# EAGLE design remote (EAGLE 6.6.0)
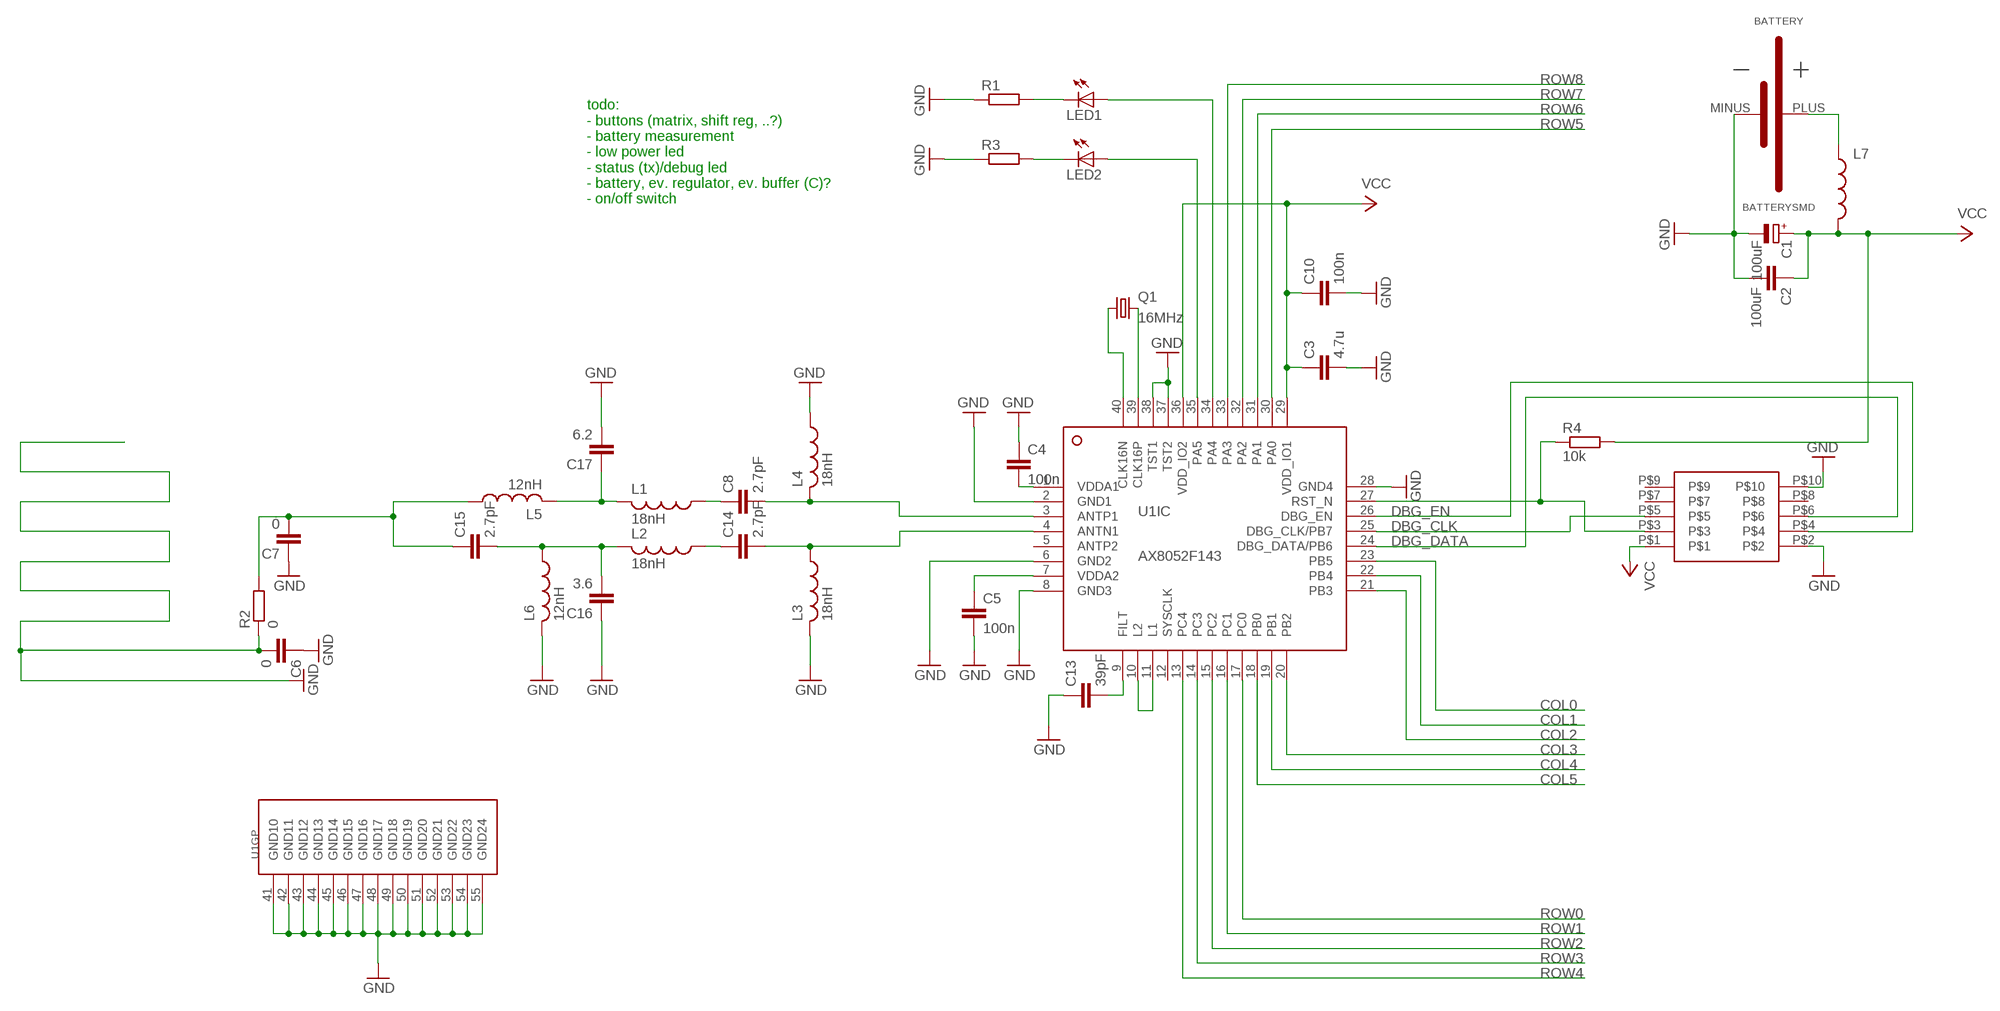
[diagram p0: schematic, sheet 1, part 1 of 2]
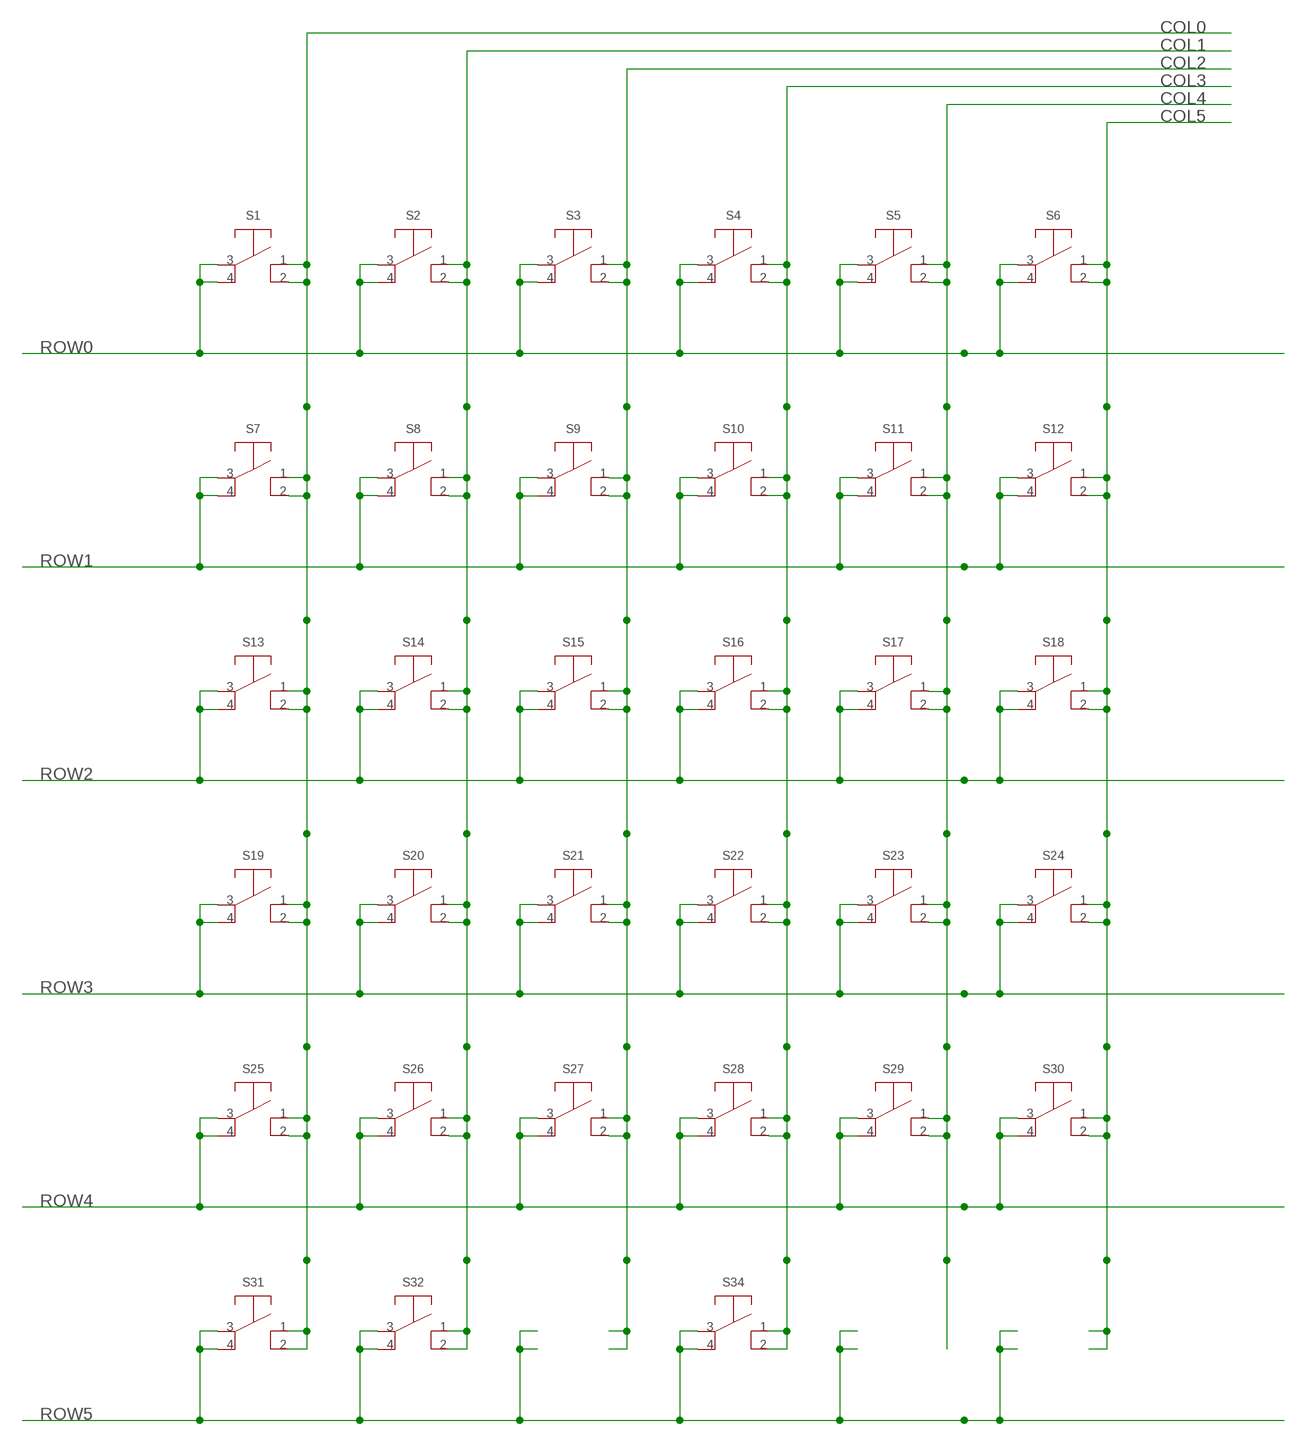
[diagram p1: schematic, sheet 1, part 2 of 2]

## Parts
BATTERY  BATTERYSMD  [CR2032-SMD]
C1  100uF  CPOL-EUE  [PANASONIC_E]
C2  100uF  C-EUC1206K  [C1206K]
C3  4.7u  C-EUC0805  [C0805]
C4  100n  C-EUC0603  [C0603]
C5  100n  C-EUC0603  [C0603]
C6  0  C-EUC0805  [C0805]
C7  0  C-EUC0805  [C0805]
C8  2.7pF  C-EUC0805  [C0805]
C10  100n  C-EUC0603  [C0603]
C13  39pF  C-EUC0805  [C0805]
C14  2.7pF  C-EUC0805  [C0805]
C15  2.7pF  C-EUC0805  [C0805]
C16  3.6  C-EUC0805  [C0805]
C17  6.2  C-EUC0805  [C0805]
L1  18nH  L-US0603  [C0603]
L2  18nH  L-US0603  [C0603]
L3  18nH  L-US0603  [C0603]
L4  18nH  L-US0603  [C0603]
L5  12nH  L-US0603  [C0603]
L6  12nH  L-US0603  [C0603]
L7  INDUCTORNPI75  [NPI75C]
LED1  LEDCHIPLED_1206  [CHIPLED_1206]
LED2  LEDCHIPLED_1206  [CHIPLED_1206]
Q1  16MHz  CRYSTALSM49  [SM49]
R1  R-EU_R0603  [R0603]
R2  0  R-EU_R0603  [R0603]
R3  R-EU_R0603  [R0603]
R4  10k  R-EU_R0603  [R0603]
S1  SWITCHSMD  [TACTILE_SWITCH_FSM2JSMA]
S2  SWITCHSMD  [TACTILE_SWITCH_FSM2JSMA]
S3  SWITCHSMD  [TACTILE_SWITCH_FSM2JSMA]
S4  SWITCHSMD  [TACTILE_SWITCH_FSM2JSMA]
S5  SWITCHSMD  [TACTILE_SWITCH_FSM2JSMA]
S6  SWITCHSMD  [TACTILE_SWITCH_FSM2JSMA]
S7  SWITCHSMD  [TACTILE_SWITCH_FSM2JSMA]
S8  SWITCHSMD  [TACTILE_SWITCH_FSM2JSMA]
S9  SWITCHSMD  [TACTILE_SWITCH_FSM2JSMA]
S10  SWITCHSMD  [TACTILE_SWITCH_FSM2JSMA]
S11  SWITCHSMD  [TACTILE_SWITCH_FSM2JSMA]
S12  SWITCHSMD  [TACTILE_SWITCH_FSM2JSMA]
S13  SWITCHSMD  [TACTILE_SWITCH_FSM2JSMA]
S14  SWITCHSMD  [TACTILE_SWITCH_FSM2JSMA]
S15  SWITCHSMD  [TACTILE_SWITCH_FSM2JSMA]
S16  SWITCHSMD  [TACTILE_SWITCH_FSM2JSMA]
S17  SWITCHSMD  [TACTILE_SWITCH_FSM2JSMA]
S18  SWITCHSMD  [TACTILE_SWITCH_FSM2JSMA]
S19  SWITCHSMD  [TACTILE_SWITCH_FSM2JSMA]
S20  SWITCHSMD  [TACTILE_SWITCH_FSM2JSMA]
S21  SWITCHSMD  [TACTILE_SWITCH_FSM2JSMA]
S22  SWITCHSMD  [TACTILE_SWITCH_FSM2JSMA]
S23  SWITCHSMD  [TACTILE_SWITCH_FSM2JSMA]
S24  SWITCHSMD  [TACTILE_SWITCH_FSM2JSMA]
S25  SWITCHSMD  [TACTILE_SWITCH_FSM2JSMA]
S26  SWITCHSMD  [TACTILE_SWITCH_FSM2JSMA]
S27  SWITCHSMD  [TACTILE_SWITCH_FSM2JSMA]
S28  SWITCHSMD  [TACTILE_SWITCH_FSM2JSMA]
S29  SWITCHSMD  [TACTILE_SWITCH_FSM2JSMA]
S30  SWITCHSMD  [TACTILE_SWITCH_FSM2JSMA]
S31  SWITCHSMD  [TACTILE_SWITCH_FSM2JSMA]
S32  SWITCHSMD  [TACTILE_SWITCH_FSM2JSMA]
S34  SWITCHSMD  [TACTILE_SWITCH_FSM2JSMA]
U1  AX8052F143HS  [QFN40-H]
U$2  2X5PIN-CONNECTOR  [2X5PIN-CONNECTOR-SMD]

## Nets
COL0: S1.P1 S1.P2 S7.P1 S7.P2 S13.P1 S13.P2 S19.P1 S19.P2 S25.P1 S25.P2 S31.P1 S31.P2 U1.23(IC:PB5)
COL1: S2.P1 S2.P2 S8.P1 S8.P2 S14.P1 S14.P2 S20.P1 S20.P2 S26.P1 S26.P2 S32.P1 S32.P2 U1.22(IC:PB4)
COL2: S3.P1 S3.P2 S9.P1 S9.P2 S15.P1 S15.P2 S21.P1 S21.P2 S27.P1 S27.P2 U1.21(IC:PB3)
COL3: S4.P1 S4.P2 S10.P1 S10.P2 S16.P1 S16.P2 S22.P1 S22.P2 S28.P1 S28.P2 S34.P1 S34.P2 U1.20(IC:PB2)
COL4: S5.P1 S5.P2 S11.P1 S11.P2 S17.P1 S17.P2 S23.P1 S23.P2 S29.P1 S29.P2 U1.19(IC:PB1)
COL5: S6.P1 S6.P2 S12.P1 S12.P2 S18.P1 S18.P2 S24.P1 S24.P2 S30.P1 S30.P2 U1.18(IC:PB0)
DBG_CLK: U1.25(IC:DBG_CLK/PB7) U$2.P$5
DBG_DATA: U1.24(IC:DBG_DATA/PB6) U$2.P$6
DBG_EN: U1.26(IC:DBG_EN) U$2.P$4
GND: BATTERY.MINUS C1.- C2.2 C3.2 C4.1 C5.2 C6.1 C6.2 C7.1 C10.2 C13.1 C16.1 C17.2 L3.2 L4.1 L6.2 R1.1 R2.1 R3.1 U1.2(IC:GND1) U1.6(IC:GND2) U1.8(IC:GND3) U1.28(IC:GND4) U1.37(IC:TST2) U1.38(IC:TST1) U1.41(GP:GND10) U1.42(GP:GND11) U1.43(GP:GND12) U1.44(GP:GND13) U1.45(GP:GND14) U1.46(GP:GND15) U1.47(GP:GND16) U1.48(GP:GND17) U1.49(GP:GND18) U1.50(GP:GND19) U1.51(GP:GND20) U1.52(GP:GND21) U1.53(GP:GND22) U1.54(GP:GND23) U1.55(GP:GND24) U$2.P$2 U$2.P$10
N$1: U1.10(IC:L2) U1.11(IC:L1)
N$2: C13.2 U1.9(IC:FILT)
N$3: C4.2 U1.1(IC:VDDA1)
N$4: LED1.A U1.34(IC:PA4)
N$5: R4.1 U1.27(IC:RST_N) U$2.P$3
N$6: C5.1 U1.7(IC:VDDA2)
N$7: C8.2 L4.2 U1.3(IC:ANTP1)
N$8: C14.2 L3.1 U1.4(IC:ANTN1)
N$9: C8.1 L1.1
N$10: C14.1 L2.1
N$11: LED2.A U1.35(IC:PA5)
N$12: C17.1 L1.2 L5.2
N$13: C15.2 C16.2 L2.2 L6.1
N$14: Q1.2 U1.39(IC:CLK16P)
N$15: Q1.1 U1.40(IC:CLK16N)
N$16: LED2.C R3.2
N$17: LED1.C R1.2
N$18: BATTERY.PLUS L7.1
N$20: C7.2 C15.1 L5.1 R2.2
ROW0: S1.P3 S1.P4 S2.P3 S2.P4 S3.P3 S3.P4 S4.P3 S4.P4 S5.P3 S5.P4 S6.P3 S6.P4 U1.17(IC:PC0)
ROW1: S7.P3 S7.P4 S8.P3 S8.P4 S9.P3 S9.P4 S10.P3 S10.P4 S11.P3 S11.P4 S12.P3 S12.P4 U1.16(IC:PC1)
ROW2: S13.P3 S13.P4 S14.P3 S14.P4 S15.P3 S15.P4 S16.P3 S16.P4 S17.P3 S17.P4 S18.P3 S18.P4 U1.15(IC:PC2)
ROW3: S19.P3 S19.P4 S20.P3 S20.P4 S21.P3 S21.P4 S22.P3 S22.P4 S23.P3 S23.P4 S24.P3 S24.P4 U1.14(IC:PC3)
ROW4: S25.P3 S25.P4 S26.P3 S26.P4 S27.P3 S27.P4 S28.P3 S28.P4 S29.P3 S29.P4 S30.P3 S30.P4 U1.13(IC:PC4)
ROW5: S31.P3 S31.P4 S32.P3 S32.P4 S34.P3 S34.P4 U1.30(IC:PA0)
ROW6: U1.31(IC:PA1)
ROW7: U1.32(IC:PA2)
ROW8: U1.33(IC:PA3)
VCC: C1.+ C2.1 C3.1 C10.1 L7.2 R4.2 U1.29(IC:VDD_IO1) U1.36(IC:VDD_IO2) U$2.P$1
Unconnected: U1.5(IC:ANTP2) U1.12(IC:SYSCLK) U$2.P$7 U$2.P$8 U$2.P$9

## Notes on the sheet
- todo:
  - buttons (matrix, shift reg, ..?)
  - battery measurement
  - low power led
  - status (tx)/debug led
  - battery, ev. regulator, ev. buffer (C)?
  - on/off switch

## Library data of the parts
BATTERY = sam:BATTERY
C1 = resistor:CPOL-EU: POLARIZED CAPACITOR, European symbol
C2-C8 C10 C13-C17 = resistor:C-EU: CAPACITOR, European symbol
L1-L6 = resistor:L-US: INDUCTOR, American symbol
L7 = SparkFun-Passives:INDUCTOR: Inductors Basic Inductor/Choke - 0603 and 1206. Footprints are not proven and vary greatly between part numbers. SRN6045- 33uH, 20% 1.4A SDR0403-560KL - 56uH, 10%, 500mA RMS/740mA peak
LED1 LED2 = led:LED: LED OSRAM: - CHIPLED LG R971, LG N971, LY N971, LG Q971, LY Q971, LO R971, LY R971 LH N974, LH R974 LS Q976, LO Q976, LY Q976 LO Q996 - Hyper CHIPLED LW Q18S LB Q993, LB Q99A, LB R99A - SideLED LS A670, LO A670, LY A670, LG A670, LP A670 LB A673, LV A673, LT A673, LW A673 LH A674 LY A675 LS A676, LA A676, LO A676, LY A676, LW A676 LS A679, LY A679, LG A679 - Hyper Micro SIDELED® LS Y876, LA Y876, LO Y876, LY Y876 LT Y87S - SmartLED LW L88C, LW L88S LB L89C, LB L89S, LG L890 LS L89K, LO L89K, LY L89K LS L896, LA L896, LO L896, LY L896 - TOPLED LS T670, LO T670, LY T670, LG T670, LP T670 LSG T670, LSP T670, LSY T670, LOP T670, LYG T670 LG T671, LOG T671, LSG T671 LB T673, LV T673, LT T673, LW T673 LH T674 LS T676, LA T676, LO T676, LY T676, LB T676, LH T676, LSB T676, LW T676 LB T67C, LV T67C, LT T67C, LS T67K, LO T67K, LY T67K, LW E67C LS E67B, LA E67B, LO E67B, LY E67B, LB E67C, LV E67C, LT E67C LW T67C LS T679, LY T679, LG T679 LS T770, LO T770, LY T770, LG T770, LP T770 LB T773, LV T773, LT T773, LW T773 LH T774 LS E675, LA E675, LY E675, LS T675 LS T776, LA T776, LO T776, LY T776, LB T776 LHGB T686 LT T68C, LB T68C - Hyper Mini TOPLED® LB M676 - Mini TOPLED Santana® LG M470 LS M47K, LO M47K, LY M47K Source: http://www.osram.convergy.de LUXEON: - LUMILED® LXK2-PW12-R00, LXK2-PW12-S00, LXK2-PW14-U00, LXK2-PW14-V00 LXK2-PM12-R00, LXK2-PM12-S00, LXK2-PM14-U00 LXK2-PE12-Q00, LXK2-PE12-R00, LXK2-PE12-S00, LXK2-PE14-T00, LXK2-PE14-U00 LXK2-PB12-K00, LXK2-PB12-L00, LXK2-PB12-M00, LXK2-PB14-N00, LXK2-PB14-P00, LXK2-PB14-Q00 LXK2-PR12-L00, LXK2-PR12-M00, LXK2-PR14-Q00, LXK2-PR14-R00 LXK2-PD12-Q00, LXK2-PD12-R00, LXK2-PD12-S00 LXK2-PH12-R00, LXK2-PH12-S00 LXK2-PL12-P00, LXK2-PL12-Q00, LXK2-PL12-R00 Source: www.luxeon.com KINGBRIGHT: KA-3528ASYC Source: www.kingbright.com
Q1 = crystal:CRYSTAL: CRYSTAL
R1-R4 = resistor:R-EU_: RESISTOR, European symbol
S1-S32 S34 = sam:SWITCH
U1 = axsem_v4-11:AX8052F143: Ultra cool AXSEM low-power narrow-band transceiver with integrated ultra-low-power AX8052 micro-controller
U$2 = sam_eagle_parts:2X5PIN-CONNECTOR

## Net classes
0 default: clearance 0.205 mm

## Board
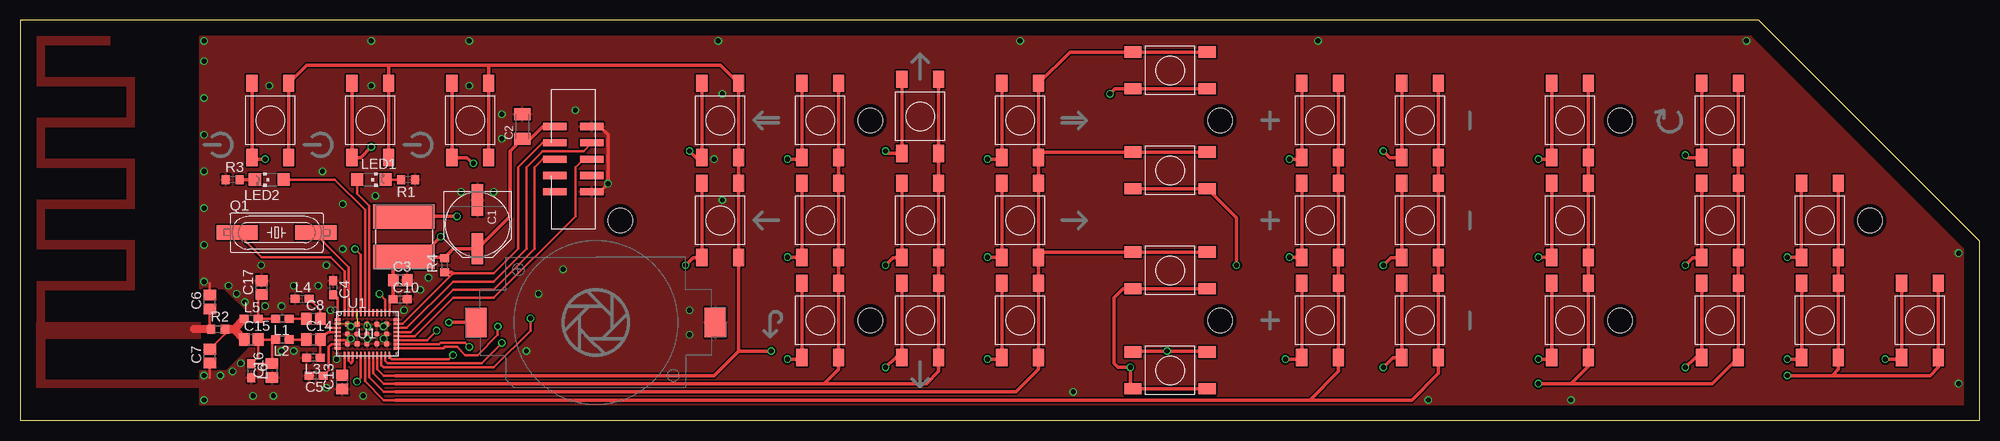
[diagram p2: board, top side]
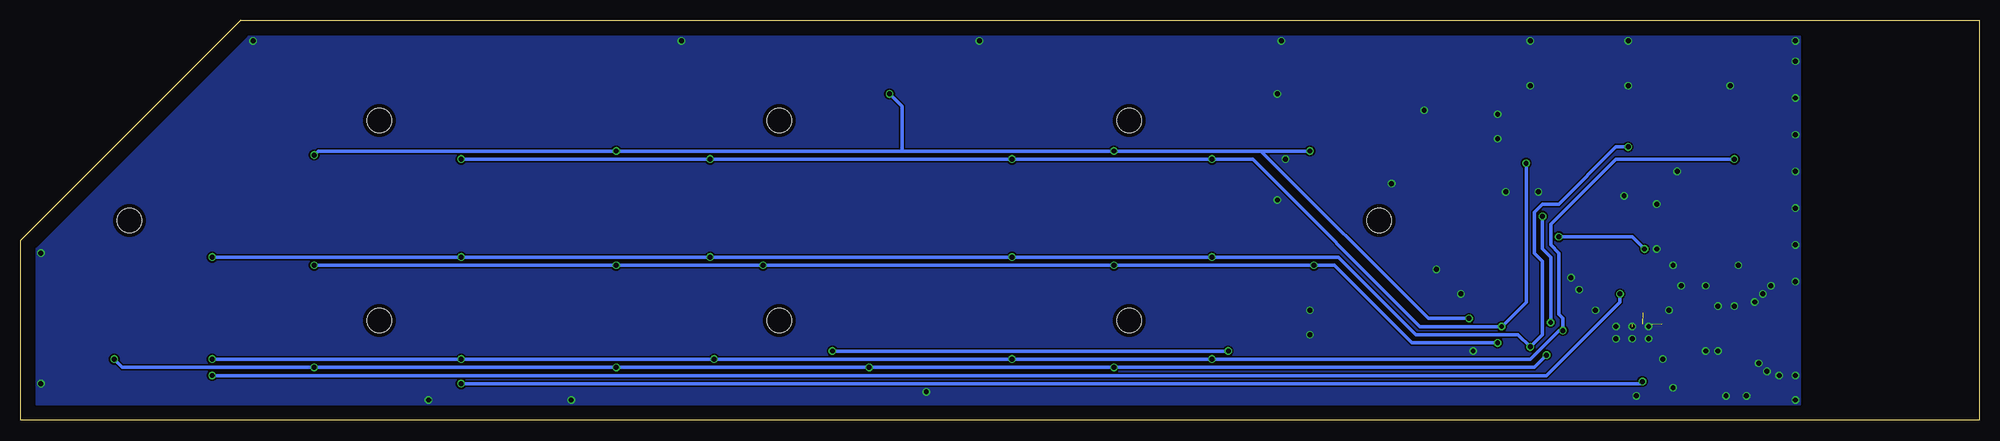
[diagram p3: board, bottom side, seen from below]

Size 240 x 49 mm. Coordinates in mm from the lower left corner, seen from the top.
Outline: 0,0 240,0 240,22 213,49 0,49 0,0
Copper layers (1*16): Top 0.035mm / dielectric 1.5mm / Bottom 0.035mm
Design rules "EagleRules": minimum track width 7mil, minimum drill 12mil, track to track 7mil, track to pad 7mil, pad to pad 7mil, via to via 7mil, smd to smd 0mil, copper to edge 20mil, drill to drill 10mil, minimum pad ring 10mil, minimum via ring 6mil, stop-mask expansion 2mil, vias tented up to drill 25mil, thermal gap 10mil
Holes 3 mm at 73.5,24.5 226.62,24.5 196,12.25 196,36.75 147,36.75 147,12.25 104.12,36.75 104.12,12.25

### Footprints (pad centres in the part's own frame; a part is rotated, then mirrored left to right if it is on the bottom)
CR2032-SMD = smd 2.6 x 3.6: MINUS -14.65,0; PLUS 14.65,0
PANASONIC_E = smd 3.8 x 1.4: + 3,0; - -3,0
C1206K = smd 1.5 x 2: 1 -1.5,0; 2 1.5,0
C0805 = smd 1.3 x 1.5: 1 -0.85,0; 2 0.85,0
C0603 = smd 1.1 x 1: 1 -0.85,0; 2 0.85,0
NPI75C = smd 3 x 7.5: 1 -2.5,0; 2 2.5,0
CHIPLED_1206 = smd 1.5 x 1.5: A 0,-1.75; C 0,1.75
SM49 = smd 5.08 x 1.778: 1 -4.826,0; 2 4.826,0
R0603 = smd 1 x 1.1: 1 -0.85,0; 2 0.85,0
TACTILE_SWITCH_FSM2JSMA = smd 1.4 x 2.1: P1 2.25,4.55; P2 2.25,-4.55; P3 -2.25,4.55; P4 -2.25,-4.55
QFN40-H = smd 0.8 x 0.3: 1 -3.6,1.75; 2 -3.6,1.25; 3 -3.6,0.75; 4 -3.6,0.25; 5 -3.6,-0.25; 6 -3.6,-0.75; 7 -3.6,-1.25; 8 -3.6,-1.75; 21 3.6,-1.75; 22 3.6,-1.25; 23 3.6,-0.75; 24 3.6,-0.25; 25 3.6,0.25; 26 3.6,0.75; 27 3.6,1.25; 28 3.6,1.75 | smd 0.3 x 0.8: 9 -2.75,-2.6; 10 -2.25,-2.6; 11 -1.75,-2.6; 12 -1.25,-2.6; 13 -0.75,-2.6; 14 -0.25,-2.6; 15 0.25,-2.6; 16 0.75,-2.6; 17 1.25,-2.6; 18 1.75,-2.6; 19 2.25,-2.6; 20 2.75,-2.6; 29 2.75,2.6; 30 2.25,2.6; 31 1.75,2.6; 32 1.25,2.6; 33 0.75,2.6; 34 0.25,2.6; 35 -0.25,2.6; 36 -0.75,2.6; 37 -1.25,2.6; 38 -1.75,2.6; 39 -2.25,2.6; 40 -2.75,2.6 | smd 0.65 x 0.65: 41 -2.4,1.2; 42 -2.4,0; 43 -2.4,-1.2; 44 -1.2,1.2; 45 -1.2,0; 46 -1.2,-1.2; 47 0,1.2; 48 0,0; 49 0,-1.2; 50 1.2,-1.2; 51 1.2,0; 52 1.2,1.2; 53 2.4,-1.2; 54 2.4,0; 55 2.4,1.2
2X5PIN-CONNECTOR-SMD = smd 2.9 x 0.89: P$1 2.5,-4; P$2 -2,-4; P$3 2.5,-2; P$4 -2,-2; P$5 2.5,0; P$6 -2,0; P$7 2.5,2; P$8 -2,2; P$9 2.5,4; P$10 -2,4

### Placement (x,y rotation side)
BATTERY  70.5,12 180 top
C1  56,24 270 top
C2  61.5,36 90 top
C3  46.55,17.17 0 top
C4  38.32,16.26 270 top
C5  36.23,5.48 180 top
C6  23.21,14.49 90 top
C7  23.21,7.87 90 top
C8  35.91,12.45 0 top
C10  46.55,14.86 0 top
C13  39.43,4.68 90 top
C14  35.91,9.91 0 top
C15  28.29,9.91 0 top
C16  30.83,6.1 90 top
C17  29.56,16.26 90 top
L1  32.1,12.45 180 top
L2  32.1,9.91 180 top
L3  35.9,7.69 180 top
L4  34.54,14.91 0 top
L5  28.29,12.45 0 top
L6  28.29,6.1 270 top
L7  47,22.5 270 top
LED1  43,29.5 270 top
LED2  30.5,29.5 90 top
Q1  31.39,23.01 0 top
R1  47.5,29.5 180 top
R2  24.21,11.18 0 top
R3  26,29.5 0 top
R4  52,19 90 top
S1  30.62,36.75 180 top
S2  42.88,36.75 180 top
S3  55.12,36.75 180 top
S4  140.88,6.12 270 top
S5  85.75,24.5 180 top
S6  85.75,36.75 180 top
S7  98,12.25 180 top
S8  98,24.5 180 top
S9  98,36.75 180 top
S10  110.25,12.25 180 top
S11  110.25,24.5 180 top
S12  110.25,37.25 180 top
S13  122.5,12.25 180 top
S14  122.5,24.5 180 top
S15  122.5,36.75 180 top
S16  140.88,18.38 270 top
S17  140.88,30.62 270 top
S18  140.88,42.88 270 top
S19  159.25,12.25 180 top
S20  159.25,24.5 180 top
S21  159.25,36.75 180 top
S22  171.5,12.25 180 top
S23  171.5,24.5 180 top
S24  171.5,36.75 180 top
S25  189.88,12.25 180 top
S26  189.88,24.5 180 top
S27  189.88,36.75 180 top
S28  208.25,12.25 180 top
S29  208.25,24.5 180 top
S30  208.25,36.75 180 top
S31  220.5,12.25 180 top
S32  220.5,24.5 180 top
S34  232.75,12.25 180 top
U1  42.47,10.58 0 top
U$1  [ARROW]  91.88,24.5 180 top
U$2  68,32 180 top
U$3  PC  [POWER_TEXT]  24.5,36.75 90 top
U$4  [APERTURE_LOGO]  70.5,12 0 top
U$5  TV  [POWER_TEXT]  36.75,36.75 90 top
U$6  AUDIO  [POWER_TEXT]  49,36.75 90 top
U$7  [HOME]  128.62,12.25 90 top
U$9  [STOP]  79.62,36.75 0 top
U$10  [ARROW]  110.25,6.12 270 top
U$11  [ARROW]  128.62,24.5 0 top
U$12  [ARROW]  110.25,42.88 90 top
U$13  [ARROW_DOUBLE]  91.88,36.75 180 top
U$14  [ARROW_DOUBLE]  128.62,36.75 0 top
U$15  [ARROW_BACK]  91.88,12.25 90 top
U$16  [PLAY_PAUSE]  79.62,24.5 90 top
U$17  [FAST_FORWARD]  134.75,30.62 90 top
U$18  [FAST_FORWARD]  134.75,18.38 270 top
U$19  [FAST_FORWARD_NEXT]  134.75,42.88 90 top
U$20  [FAST_FORWARD_NEXT]  134.75,6.12 270 top
U$21  [PLUS]  153.12,24.5 90 top
U$22  [PLUS]  153.12,36.75 90 top
U$23  [PLUS]  153.12,12.25 90 top
U$24  [MINUS]  177.62,24.5 90 top
U$25  [MINUS]  177.62,36.75 90 top
U$26  [MINUS]  177.62,12.25 90 top
U$27  [ARROW_ROT_RIGHT]  202.12,36.75 90 top

### Tracks (layer width: path | path; a pad name or v marks a point on that pad's centre or on a via)
COL0  (via drill 0.6)
  Top 0.305: U1.23 49.83,9.83 v51,11
  Top 0.406: v216.5,7.5 218.05,7.5 S31.P1 S31.P2 | v94,7.5 95.55,7.5 S7.P1 S7.P2 | v118.5,7.5 120.05,7.5 S13.P1 S13.P2 | v155,7.5 156.8,7.5 S19.P1 S19.P2 | v186,7.5 187.43,7.5 S25.P1 S25.P2 | v30,32 28.57,32 S1.P1 S1.P2
  Bottom 0.406: v216.5,7.5 v186,7.5 v155,7.5 v118.5,7.5 v94,7.5 55,7.5 51.5,11 v51,11 51,12.5 51.5,13 51.5,20.5 52.5,21.5 52.5,24 44.5,32 v30,32
COL1  (via drill 0.6)
  Top 0.305: U1.22 51.33,9.33 51.5,9.5 54.5,9.5 v55,9
  Top 0.406: v216.5,20 218.2,20 | 218.2,20 S32.P1 | v94,20 95.7,20 S8.P1 S8.P2 | v118.5,20 120.2,20 S14.P1 S14.P2 | v155.5,20 156.95,20 S20.P1 S20.P2 | v186,20 187.57,20 S26.P1 S26.P2 | 218.2,20 218.2,29 S32.P2 | S2.P2 S2.P1 41.7,32.2 v43,33.5
  Bottom 0.406: v216.5,20 v186,20 v155.5,20 v118.5,20 v94,20 78.5,20 69,10.5 56.5,10.5 v55,9 53.5,10.5 53.5,19.5 54.5,20.5 54.5,25.5 53.5,26.5 51.5,26.5 44.5,33.5 v43,33.5
COL2  (via drill 0.6)
  Top 0.305: U1.21 51.83,8.83 52,9 53.5,9 54.5,8 56,8 58.5,10.5 v58.5,11.5
  Top 0.406: v186,32 187.43,32 S27.P1 S27.P2 | v155.5,32 156.8,32 S21.P1 S21.P2 | v118.5,32 120.05,32 S15.P1 S15.P2 | v94,32 95.55,32 S9.P1 S9.P2 | 52.88,41.12 S3.P2 S3.P1 54.7,32.2 v55.5,31.5
  Bottom 0.406: v186,32 v155.5,32 v118.5,32 v94,32 89,32 68.5,11.5 v58.5,11.5 55.5,14.5 v55.5,31.5
COL3  (via drill 0.6)
  Top 0.305: U1.20 45.22,7.78 45.5,7.5 52.5,7.5 v53,8
  Top 0.406: v228.5,7.5 230.3,7.5 S34.P1 S34.P2 | v204,6.5 205.2,7.7 S28.P1 S28.P2 | v167,6.5 168.2,7.7 S22.P1 S22.P2 | v106,6.5 107.2,7.7 S10.P1 S10.P2 | S4.P1 S4.P2 136,4.2 v136,6.5 134.5,6.5 134,7 134,15 135.12,16.12 S16.P2 S16.P1 145.88,16.12
  Bottom 0.406: v53,8 54.5,6.5 v106,6.5 134,6.5 v136,6.5 v167,6.5 v204,6.5 227.5,6.5 v228.5,7.5
COL4  (via drill 0.6)
  Top 0.305: U1.19 44.72,7.28 45,7 56.5,7 v59,9.5
  Top 0.406: v204,19 204.95,19.95 S29.P1 S29.P2 | v167,19 167.95,19.95 S23.P1 S23.P2 | v106,19 106.95,19.95 S11.P1 S11.P2 | v81.5,19 82.45,19.95 S5.P1 S5.P2 | S17.P2 S17.P1 149,24.8 v149,19
  Bottom 0.406: v204,19 v167,19 v149,19 v106,19 v81.5,19 79,19 69.5,9.5 v59,9.5
COL5  (via drill 0.6)
  Top 0.305: U1.18 44.22,6.78 44.5,6.5 58,6.5 62.5,11 v62.5,12.5
  Top 0.406: v204,32.5 204.3,32.2 205.5,32.2 | 205.5,32.2 S30.P1 | v167,33 167.8,32.2 S24.P1 S24.P2 | v133.5,40 134.12,40.62 S18.P2 S18.P1 | v106,33 106.3,32.7 S12.P1 S12.P2 | v82,33 82.8,32.2 S6.P1 S6.P2 | S30.P2 206,32.7 205.5,32.2
  Bottom 0.406: v82,33 88,33 | 88,33 v106,33 132,33 | 132,33 v167,33 203.5,33 v204,32.5 | v62.5,12.5 67.5,12.5 88,33 | v133.5,40 132,38.5 132,33
DBG_CLK
  Top 0.305: U1.25 47.83,10.83 53,16 58,16 63,21 63,31 64,32 U$2.P$5
DBG_DATA
  Top 0.305: U1.24 48.33,10.33 53,15 58,15 68,25 68,31 69,32 U$2.P$6
DBG_EN
  Top 0.305: U1.26 47.33,11.33 53,17 58,17 62,21 62,31 64,33 69,33 U$2.P$4
GND  (via drill 0.6)  (3 unrouted)
  Top 0.3: U1.6 40.07,9.83 U1.43
  Top 0.305: C6.1 23.21,11.33 R2.1 | C7.1 23.21,5.21 23.2,5.2 | C6.2 23.21,16.79 23.2,16.8
  Top 0.406: U$2.P$10 71,28 v72,29 72,35 71,36 U$2.P$2
  Top 1: R2.1 21.27,11.18
  other vias: 50,17.5 49,16 27.5,14.5 30,14 36.5,16.5 26.5,15.5 25.5,16.5 27,7 26,6 24.5,5.5 22.5,17 22.5,5.5 22.5,2.5 32,8.5 33.5,8.5 38.75,7.5 28.5,3 31,3 33.5,16.5 37.5,19 29.5,19 22.5,21.5 22.5,26 40.5,11.5 40.5,10 42.5,10 44.5,10 44.5,11.5 42.5,11.5 47,13.5 82,13.5 82,10.5 39.5,21 22.5,30.5 22.5,46.5 22.5,35 22.5,39.5 22.5,44 68,38 59,37.5 59,34.5 58,28 54,28 66.5,18.5 63.5,15.5 62,8.5 42,3 37.5,4 32,14 38,13.5 85.5,46.5 122.5,46.5 159,46.5 211.5,46.5 237.5,20.5 237.5,4.5 190,2.5 172.5,2.5 129,3.5 37,30.5 43.5,27.5 39.5,26.5 30.5,41 43,41 55,41 43,46.5 55,46.5 85,32 86,40 86,27
  pour Top: 22,12 22,10 3,10 3,5 22,5 22,4 2,4 2,12
  pour Top: 3,11 3,16 14,16 14,22 3,22 3,26 14,26 14,32 3,32 3,36 14,36 14,42 3,42 3,46 11,46 11,47 2,47 2,41 13,41 13,37 2,37 2,31 13,31 13,27 2,27 2,21 13,21 13,17 2,17 2,11
  pour Top: 22,2 22,6 25.2,6 28.2,9 37,9 37,13 28.2,13 25,16.2 22,16.2 22,47 212,47 238,21 238,2
  pour Bottom: 22,47 212,47 238,21 238,2 22,2
N$1
  Top 0.305: U1.10 40.22,7.28 40.5,7 40.72,7.22 U1.11
N$2
  Top 0.305: U1.9 39.72,5.49 C13.2
N$3
  Top 0.305: U1.1 38.87,15.01 C4.2
N$4
  Top 0.305: U1.34 42.72,26.28 41.25,27.75 LED1.A
N$5
  Top 0.305: U1.27 46.83,11.83 53,18 58,18 61,21 61,31 64,34 U$2.P$3
  Top 0.406: R4.1 52.85,18.15 53,18
N$6
  Top 0.305: U1.7 38.13,9.33 37.8,9 37.8,6.15 37.16,5.51 arc-45 C5.1
N$7
  Top 0.3: C8.2 36.76,13.54 L4.2
  Top 0.305: U1.3 38.29,11.33 arc-45 37.59,11.62 C8.2
N$8
  Top 0.305: U1.4 38.09,10.83 arc45 37.39,10.54 C14.2 L3.1
N$9
  Top 0.3: C8.1 L1.1
N$10
  Top 0.3: L2.1 C14.1
N$11
  Top 0.305: U1.35 42.22,25.78 38.5,29.5 LED2.A
N$12
  Top 0.3: L1.2 L5.2 29.14,14.99 C17.1
N$13
  Top 0.3: C16.2 30.83,9.49 L2.2 C15.2 29.14,7.8 L6.1 30.95,6.95 31,7
N$14
  Top 0.305: Q1.2 37.22,21.78 40.22,18.78 U1.39
N$15
  Top 0.305: U1.40 39.72,18.28 38,20 29.57,20 Q1.1
N$16
  Top 0.406: R3.2 LED2.C
N$17
  Top 0.305: LED1.C R1.2
N$18  (via drill 0.6)
  Top 0.406: L7.1 v53.5,25 | v52.5,12 BATTERY.PLUS
  Bottom 0.406: v53.5,25 53.5,21 52.5,20 v52.5,12
N$20
  Top 0.305: R2.2 25.06,10.57 C7.2
  Top 1: L5.1 26.17,11.18 C15.1
  Top 1.016: R2.2 26.17,11.18
ROW0  (via drill 0.6)
  Top 0.305: U1.17 43.72,6.28 44.5,5.5 46,5.5
  Top 0.406: 88,8.5 85,5.5 46,5.5 | 88,8.5 S5.P3 S5.P4 S6.P3 S6.P4 85.8,43.5 57.5,43.5 | 57.5,43.5 45,43.5 | 45,43.5 35.08,43.5 S1.P4 S1.P3 | 45,43.5 45.12,43.38 S2.P4 S2.P3 | 57.5,43.5 57.38,43.38 S3.P4 S3.P3 | 88,8.5 v92,8.5 | S4.P3 145.3,8.5 v140.5,8.5 136.45,8.5 S4.P4
  Bottom 0.406: v92,8.5 v140.5,8.5
ROW1
  Top 0.305: U1.16 43.22,5.78 44.5,4.5 46,4.5
  Top 0.406: 98.5,4.5 100.25,6.25 S7.P3 S7.P4 S8.P3 S8.P4 S9.P3 S9.P4 | 98.5,4.5 111,4.5 112.5,6 S10.P3 S10.P4 S11.P3 S11.P4 S12.P3 S12.P4 | 46,4.5 98.5,4.5
ROW2
  Top 0.305: U1.15 42.72,5.28 44.5,3.5 46,3.5
  Top 0.406: S16.P4 136.12,20.62 136,20.5 | S14.P3 S13.P4 S13.P3 124.75,6.25 122,3.5 46,3.5 | S14.P3 S14.P4 S15.P3 | S15.P3 S15.P4 128.57,45.12 S18.P4 S18.P3 | S15.P3 125.42,32.88 S17.P4 S17.P3 | S14.P3 125.42,20.62 S16.P4 | S16.P4 S16.P3
ROW3
  Top 0.305: U1.14 42.22,4.78 44.5,2.5 46,2.5
  Top 0.406: 158,2.5 161.5,6 S19.P3 S19.P4 S20.P3 S20.P4 S21.P3 S21.P4 | 158,2.5 170.5,2.5 173.75,5.75 S22.P3 S22.P4 S23.P3 S23.P4 S24.P3 S24.P4 | 46,2.5 158,2.5
ROW4  (via drill 0.6)
  Top 0.305: U1.13 41.72,5.22 v41.25,4.75
  Top 0.406: S30.P4 S30.P3 S29.P4 S29.P3 S28.P4 S28.P3 207.3,4.5 190,4.5 | S27.P4 S27.P3 S26.P4 S26.P3 S25.P4 S25.P3 192.12,6.62 190,4.5 | 190,4.5 v186,4.5
  Bottom 0.406: v186,4.5 41.5,4.5 v41.25,4.75
ROW5  (via drill 0.6)
  Top 0.305: U1.30 44.72,14.78 v44,15.5
  Top 0.406: S32.P4 S32.P3 S31.P4 S31.P3 222.75,6.25 222,5.5 | S34.P4 S34.P3 235,6.5 234,5.5 222,5.5 | v216.5,5.5 222,5.5
  Bottom 0.406: v216.5,5.5 53,5.5 44,14.5 v44,15.5
VCC  (via drill 0.6)
  Top 0.305: U1.36 41.72,20.28 v41,21 | U1.29 45.22,14.38 C10.1
  Top 0.406: 53,21 C1.+ 60,25 60,33 C2.1 62.5,34.5 64,36 U$2.P$1 | R4.2 53,21 | C10.1 C3.1 45.7,18.7 L7.2 49,20 | 53,21 52,20 49,20 | v51.5,22.5 49,20
  Bottom 0.406: v41,21 42.5,22.5 v51.5,22.5

### Text on the board
tDocu: ZOOM | 1:1 | OK | VOL | MUTE | INFO | NEXT | CHANNEL | TV-PROG | CTX-MENU | SUBTITLE | ASPECT R.
bDocu: Samuel Bryner (2014, rev 4)
Notes: Use raster of 6.125mm for buttons, labels and holes.